# EAGLE schematic 01-mcu (EAGLE 9.3.0)
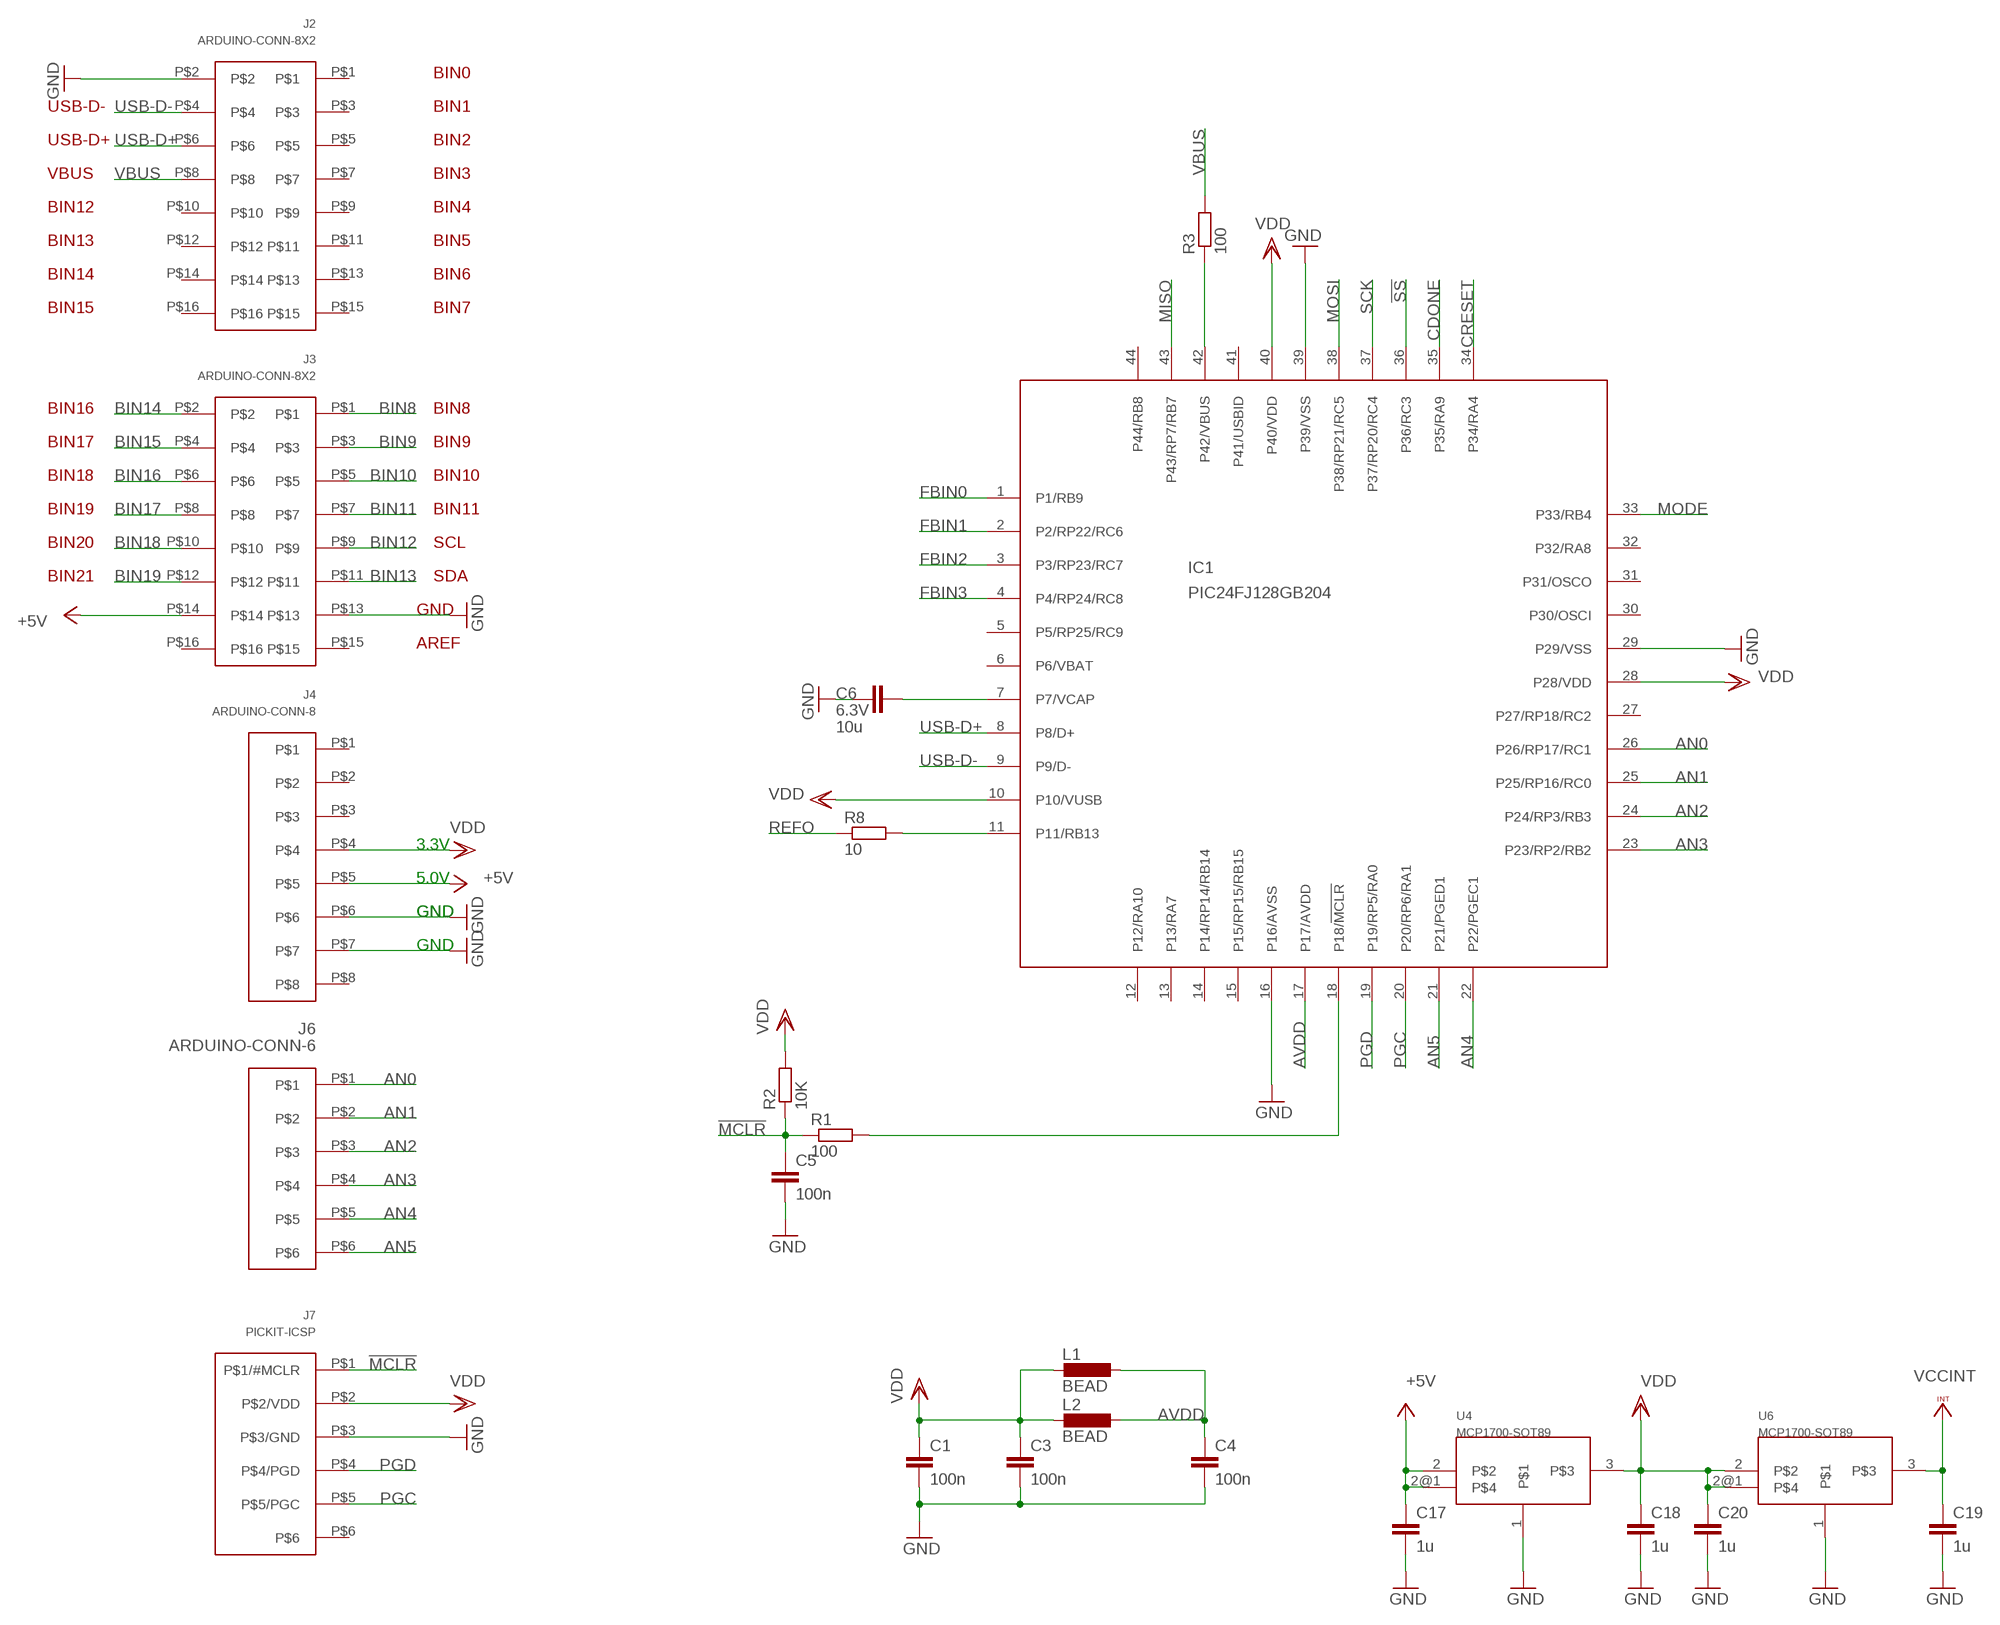
[diagram p0: schematic, sheet 1, part 1 of 2]
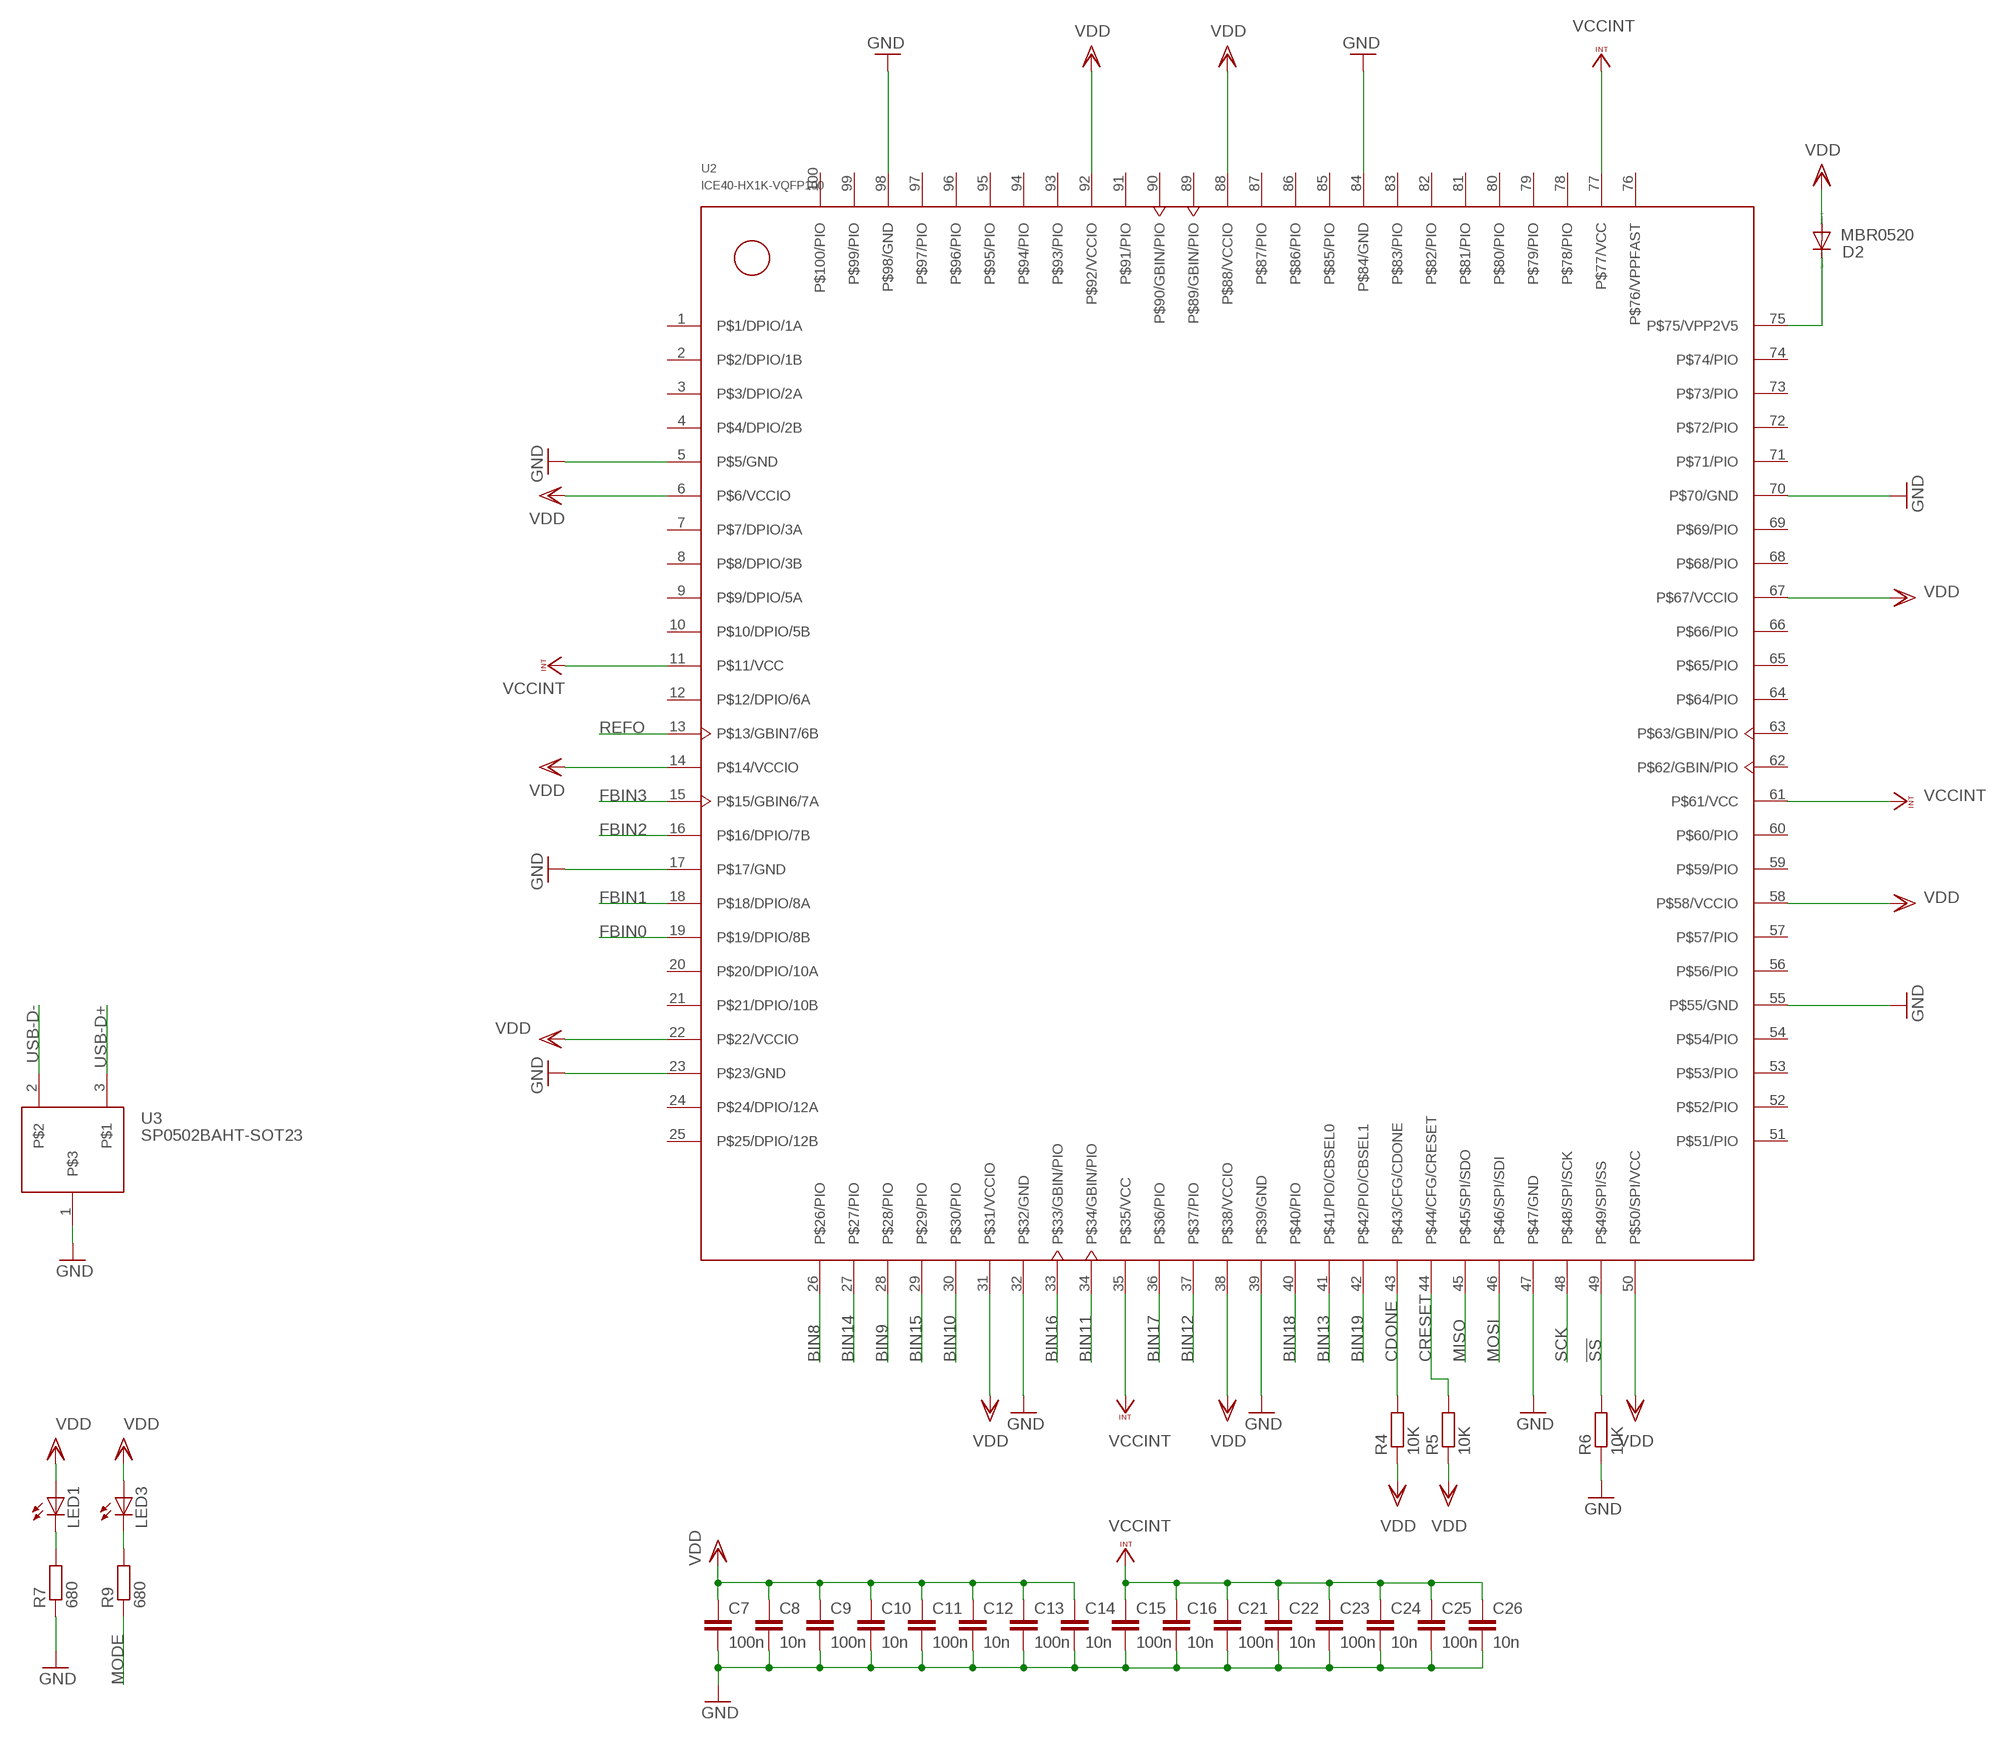
[diagram p1: schematic, sheet 1, part 2 of 2]

## Parts
C1  100n  C-EUC0805  [C0805]
C3  100n  C-EUC0805  [C0805]
C4  100n  C-EUC0805  [C0805]
C5  100n  C-EUC0805  [C0805]
C6  10u  C-EUC0805  [C0805]
C7  100n  C-EUC0805  [C0805]
C8  10n  C-EUC0805  [C0805]
C9  100n  C-EUC0805  [C0805]
C10  10n  C-EUC0805  [C0805]
C11  100n  C-EUC0805  [C0805]
C12  10n  C-EUC0805  [C0805]
C13  100n  C-EUC0805  [C0805]
C14  10n  C-EUC0805  [C0805]
C15  100n  C-EUC0805  [C0805]
C16  10n  C-EUC0805  [C0805]
C17  1u  C-EUC0805  [C0805]
C18  1u  C-EUC0805  [C0805]
C19  1u  C-EUC0805  [C0805]
C20  1u  C-EUC0805  [C0805]
C21  100n  C-EUC0805  [C0805]
C22  10n  C-EUC0805  [C0805]
C23  100n  C-EUC0805  [C0805]
C24  10n  C-EUC0805  [C0805]
C25  100n  C-EUC0805  [C0805]
C26  10n  C-EUC0805  [C0805]
D2  MBR0520  [MBR0520-SOD-123_MINI-SMA]
IC1  PIC24FJ128GB204  [TQFP44]
J2  ARDUINO-CONN-8X2  [ARDUINO-CONN-8X2]
J3  ARDUINO-CONN-8X2  [ARDUINO-CONN-8X2]
J4  ARDUINO-CONN-8  [ARDUINO-CONN-8]
J6  ARDUINO-CONN-6  [ARDUINO-CONN-6]
J7  PICKIT-ICSP  [PICKIT-ICSP]
L1  BEAD  [L0805]
L2  BEAD  [L0805]
LED1  LEDCHIP-LED0805  [CHIP-LED0805]
LED3  LEDCHIP-LED0805  [CHIP-LED0805]
R1  100  R-EU_R0805  [R0805]
R2  10K  R-EU_R0805  [R0805]
R3  100  R-EU_R0805  [R0805]
R4  10K  R-EU_R0805  [R0805]
R5  10K  R-EU_R0805  [R0805]
R6  10K  R-EU_R0805  [R0805]
R7  680  R-EU_R0805  [R0805]
R8  10  R-EU_R0805  [R0805]
R9  680  R-EU_R0805  [R0805]
U2  ICE40-HX1K-VQFP100  [TQFP100-14X14]
U3  SP0502BAHT-SOT23  [SOT23]
U4  MCP1700-SOT89  [MCP1700-SOT89]
U6  MCP1700-SOT89  [MCP1700-SOT89]

## Nets
!MCLR: C5.1 J7.P$1(P$1/#MCLR) R1.1 R2.1
!SS: IC1.36(P36/RC3) R6.2 U2.49(P$49/SPI/SS)
+5V: C17.1 J3.P$14 J4.P$5 U4.2 U4.2@1
AN0: IC1.26(P26/RP17/RC1) J6.P$1
AN1: IC1.25(P25/RP16/RC0) J6.P$2
AN2: IC1.24(P24/RP3/RB3) J6.P$3
AN3: IC1.23(P23/RP2/RB2) J6.P$4
AN4: IC1.22(P22/PGEC1) J6.P$5
AN5: IC1.21(P21/PGED1) J6.P$6
AVDD: C4.1 IC1.17(P17/AVDD) L1.2 L2.2
BIN8: J3.P$1 U2.26(P$26/PIO)
BIN9: J3.P$3 U2.28(P$28/PIO)
BIN10: J3.P$5 U2.30(P$30/PIO)
BIN11: J3.P$7 U2.34(P$34/GBIN/PIO)
BIN12: J3.P$9 U2.37(P$37/PIO)
BIN13: J3.P$11 U2.41(P$41/PIO/CBSEL0)
BIN14: J3.P$2 U2.27(P$27/PIO)
BIN15: J3.P$4 U2.29(P$29/PIO)
BIN16: J3.P$6 U2.33(P$33/GBIN/PIO)
BIN17: J3.P$8 U2.36(P$36/PIO)
BIN18: J3.P$10 U2.40(P$40/PIO)
BIN19: J3.P$12 U2.42(P$42/PIO/CBSEL1)
CDONE: IC1.35(P35/RA9) R4.2 U2.43(P$43/CFG/CDONE)
CRESET: IC1.34(P34/RA4) R5.2 U2.44(P$44/CFG/CRESET)
FBIN0: IC1.1(P1/RB9) U2.19(P$19/DPIO/8B)
FBIN1: IC1.2(P2/RP22/RC6) U2.18(P$18/DPIO/8A)
FBIN2: IC1.3(P3/RP23/RC7) U2.16(P$16/DPIO/7B)
FBIN3: IC1.4(P4/RP24/RC8) U2.15(P$15/GBIN6/7A)
GND: C1.2 C3.2 C4.2 C5.2 C6.1 C7.2 C8.2 C9.2 C10.2 C11.2 C12.2 C13.2 C14.2 C15.2 C16.2 C17.2 C18.2 C19.2 C20.2 C21.2 C22.2 C23.2 C24.2 C25.2 C26.2 IC1.16(P16/AVSS) IC1.29(P29/VSS) IC1.39(P39/VSS) J2.P$2 J3.P$13 J4.P$6 J4.P$7 J7.P$3(P$3/GND) R6.1 R7.1 U2.5(P$5/GND) U2.17(P$17/GND) U2.23(P$23/GND) U2.32(P$32/GND) U2.39(P$39/GND) U2.47(P$47/GND) U2.55(P$55/GND) U2.70(P$70/GND) U2.84(P$84/GND) U2.98(P$98/GND) U3.1 U4.1 U6.1
MISO: IC1.43(P43/RP7/RB7) U2.45(P$45/SPI/SDO)
MODE: IC1.33(P33/RB4) R9.1
MOSI: IC1.38(P38/RP21/RC5) U2.46(P$46/SPI/SDI)
N$1: IC1.42(P42/VBUS) R3.1
N$2: D2.C U2.75(P$75/VPP2V5)
N$3: IC1.18(P18/!MCLR) R1.2
N$4: IC1.11(P11/RB13) R8.2
N$5: C6.2 IC1.7(P7/VCAP)
N$8: LED1.C R7.2
N$11: LED3.C R9.2
PGC: IC1.20(P20/RP6/RA1) J7.P$5(P$5/PGC)
PGD: IC1.19(P19/RP5/RA0) J7.P$4(P$4/PGD)
REFO: R8.1 U2.13(P$13/GBIN7/6B)
SCK: IC1.37(P37/RP20/RC4) U2.48(P$48/SPI/SCK)
USB-D+: IC1.8(P8/D+) J2.P$6 U3.3
USB-D-: IC1.9(P9/D-) J2.P$4 U3.2
VBUS: J2.P$8 R3.2
VCCINT: C15.1 C16.1 C19.1 C21.1 C22.1 C23.1 C24.1 C25.1 C26.1 U2.11(P$11/VCC) U2.35(P$35/VCC) U2.61(P$61/VCC) U2.77(P$77/VCC) U6.3
VDD: C1.1 C3.1 C7.1 C8.1 C9.1 C10.1 C11.1 C12.1 C13.1 C14.1 C18.1 C20.1 D2.A IC1.10(P10/VUSB) IC1.28(P28/VDD) IC1.40(P40/VDD) J4.P$4 J7.P$2(P$2/VDD) L1.1 L2.1 LED1.A LED3.A R2.2 R4.1 R5.1 U2.6(P$6/VCCIO) U2.14(P$14/VCCIO) U2.22(P$22/VCCIO) U2.31(P$31/VCCIO) U2.38(P$38/VCCIO) U2.50(P$50/SPI/VCC) U2.58(P$58/VCCIO) U2.67(P$67/VCCIO) U2.88(P$88/VCCIO) U2.92(P$92/VCCIO) U4.3 U6.2 U6.2@1
Unconnected: IC1.5(P5/RP25/RC9) IC1.6(P6/VBAT) IC1.12(P12/RA10) IC1.13(P13/RA7) IC1.14(P14/RP14/RB14) IC1.15(P15/RP15/RB15) IC1.27(P27/RP18/RC2) IC1.30(P30/OSCI) IC1.31(P31/OSCO) IC1.32(P32/RA8) IC1.41(P41/USBID) IC1.44(P44/RB8) J2.P$1 J2.P$3 J2.P$5 J2.P$7 J2.P$9 J2.P$10 J2.P$11 J2.P$12 J2.P$13 J2.P$14 J2.P$15 J2.P$16 J3.P$15 J3.P$16 J4.P$1 J4.P$2 J4.P$3 J4.P$8 J7.P$6 U2.1(P$1/DPIO/1A) U2.2(P$2/DPIO/1B) U2.3(P$3/DPIO/2A) U2.4(P$4/DPIO/2B) U2.7(P$7/DPIO/3A) U2.8(P$8/DPIO/3B) U2.9(P$9/DPIO/5A) U2.10(P$10/DPIO/5B) U2.12(P$12/DPIO/6A) U2.20(P$20/DPIO/10A) U2.21(P$21/DPIO/10B) U2.24(P$24/DPIO/12A) U2.25(P$25/DPIO/12B) U2.51(P$51/PIO) U2.52(P$52/PIO) U2.53(P$53/PIO) U2.54(P$54/PIO) U2.56(P$56/PIO) U2.57(P$57/PIO) U2.59(P$59/PIO) U2.60(P$60/PIO) U2.62(P$62/GBIN/PIO) U2.63(P$63/GBIN/PIO) U2.64(P$64/PIO) U2.65(P$65/PIO) U2.66(P$66/PIO) U2.68(P$68/PIO) U2.69(P$69/PIO) U2.71(P$71/PIO) U2.72(P$72/PIO) U2.73(P$73/PIO) U2.74(P$74/PIO) U2.76(P$76/VPPFAST) U2.78(P$78/PIO) U2.79(P$79/PIO) U2.80(P$80/PIO) U2.81(P$81/PIO) U2.82(P$82/PIO) U2.83(P$83/PIO) U2.85(P$85/PIO) U2.86(P$86/PIO) U2.87(P$87/PIO) U2.89(P$89/GBIN/PIO) U2.90(P$90/GBIN/PIO) U2.91(P$91/PIO) U2.93(P$93/PIO) U2.94(P$94/PIO) U2.95(P$95/PIO) U2.96(P$96/PIO) U2.97(P$97/PIO) U2.99(P$99/PIO) U2.100(P$100/PIO)

## Notes on the sheet
- BIN0
- USB-D- | BIN1
- USB-D+ | BIN2
- VBUS | BIN3
- BIN12 | BIN4
- BIN13 | BIN5
- BIN14 | BIN6
- BIN15 | BIN7
- BIN16 | BIN8
- BIN17 | BIN9
- BIN18 | BIN10
- BIN19 | BIN11
- BIN20 | SCL
- BIN21 | SDA
- GND
- AREF
- 3.3V
- 5.0V
- GND | GND
- GND

## Library data of the parts
C1 C3-C5 C7-C26 = rcl:C-EU: CAPACITOR, European symbol; SPICEPREFIX: C
C6 = rcl:C-EU: CAPACITOR, European symbol; RATING: 6.3V; SPICEPREFIX: C
D2 = MIDI router MCU parts:MBR0520
IC1 = MIDI router MCU parts:PIC24FJ128GB204: PIC24FJ64GA00416-bit microcontroller Auto generated by make-symbol-device-package-bsdl.ulp Rev. 25 Source: PIC24FJ64GA004.bsd
J2 J3 = MIDI router MCU parts:ARDUINO-CONN-8X2
J4 = MIDI router MCU parts:ARDUINO-CONN-8
J6 = MIDI router MCU parts:ARDUINO-CONN-6
J7 = MIDI router MCU parts:PICKIT-ICSP
L1 L2 = MIDI router MCU parts:BEAD
LED1 LED3 = MIDI router MCU parts:LED: LED OSRAM: - CHIPLED LG R971, LG N971, LY N971, LG Q971, LY Q971, LO R971, LY R971 LH N974, LH R974 LS Q976, LO Q976, LY Q976 LO Q996 - Hyper CHIPLED LW Q18S LB Q993, LB Q99A, LB R99A - SideLED LS A670, LO A670, LY A670, LG A670, LP A670 LB A673, LV A673, LT A673, LW A673 LH A674 LY A675 LS A676, LA A676, LO A676, LY A676, LW A676 LS A679, LY A679, LG A679 - Hyper Micro SIDELED® LS Y876, LA Y876, LO Y876, LY Y876 LT Y87S - SmartLED LW L88C, LW L88S LB L89C, LB L89S, LG L890 LS L89K, LO L89K, LY L89K LS L896, LA L896, LO L896, LY L896 - TOPLED LS T670, LO T670, LY T670, LG T670, LP T670 LSG T670, LSP T670, LSY T670, LOP T670, LYG T670 LG T671, LOG T671, LSG T671 LB T673, LV T673, LT T673, LW T673 LH T674 LS T676, LA T676, LO T676, LY T676, LB T676, LH T676, LSB T676, LW T676 LB T67C, LV T67C, LT T67C, LS T67K, LO T67K, LY T67K, LW E67C LS E67B, LA E67B, LO E67B, LY E67B, LB E67C, LV E67C, LT E67C LW T67C LS T679, LY T679, LG T679 LS T770, LO T770, LY T770, LG T770, LP T770 LB T773, LV T773, LT T773, LW T773 LH T774 LS E675, LA E675, LY E675, LS T675 LS T776, LA T776, LO T776, LY T776, LB T776 LHGB T686 LT T68C, LB T68C - Hyper Mini TOPLED® LB M676 - Mini TOPLED Santana® LG M470 LS M47K, LO M47K, LY M47K Source: http://www.osram.convergy.de LUXEON: - LUMILED® LXK2-PW12-R00, LXK2-PW12-S00, LXK2-PW14-U00, LXK2-PW14-V00 LXK2-PM12-R00, LXK2-PM12-S00, LXK2-PM14-U00 LXK2-PE12-Q00, LXK2-PE12-R00, LXK2-PE12-S00, LXK2-PE14-T00, LXK2-PE14-U00 LXK2-PB12-K00, LXK2-PB12-L00, LXK2-PB12-M00, LXK2-PB14-N00, LXK2-PB14-P00, LXK2-PB14-Q00 LXK2-PR12-L00, LXK2-PR12-M00, LXK2-PR14-Q00, LXK2-PR14-R00 LXK2-PD12-Q00, LXK2-PD12-R00, LXK2-PD12-S00 LXK2-PH12-R00, LXK2-PH12-S00 LXK2-PL12-P00, LXK2-PL12-Q00, LXK2-PL12-R00 Source: www.luxeon.com KINGBRIGHT: KA-3528ASYC Source: www.kingbright.com
R1-R9 = rcl:R-EU_: RESISTOR, European symbol; SPICEPREFIX: R
U2 = MIDI router MCU parts:ICE40-HX1K-VQFP100
U3 = MIDI router MCU parts:SP0502BAHT-SOT23
U4 U6 = MIDI router parts:MCP1700-SOT89